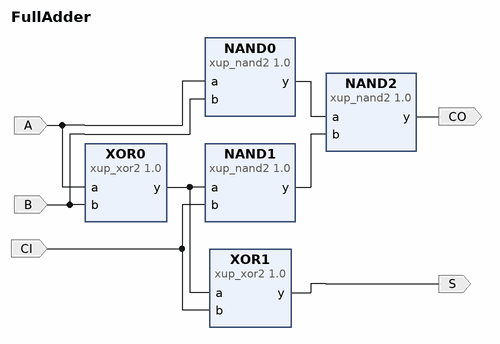
[diagram p0: block diagram of the top level]
# Vivado block design FullAdder, xc7a35tcpg236-1, Vivado 2017.2
create_bd_design FullAdder

create_bd_port -dir I A
create_bd_port -dir I B
create_bd_port -dir I CI
create_bd_port -dir O S
create_bd_port -dir O CO

create_bd_cell -type ip -vlnv xilinx.com:xup:xup_xor2:1.0 XOR0
create_bd_cell -type ip -vlnv xilinx.com:xup:xup_xor2:1.0 XOR1
create_bd_cell -type ip -vlnv xilinx.com:xup:xup_nand2:1.0 NAND0
create_bd_cell -type ip -vlnv xilinx.com:xup:xup_nand2:1.0 NAND1
create_bd_cell -type ip -vlnv xilinx.com:xup:xup_nand2:1.0 NAND2

# ---- connections ----

connect_bd_net [get_bd_pins XOR1/y] [get_bd_ports S]
connect_bd_net [get_bd_pins NAND0/y] [get_bd_pins NAND2/a]
connect_bd_net [get_bd_pins NAND1/y] [get_bd_pins NAND2/b]
connect_bd_net [get_bd_pins NAND2/y] [get_bd_ports CO]
connect_bd_net [get_bd_ports A] [get_bd_pins XOR0/a] [get_bd_pins NAND0/a]
connect_bd_net [get_bd_ports B] [get_bd_pins XOR0/b] [get_bd_pins NAND0/b]
connect_bd_net [get_bd_pins XOR0/y] [get_bd_pins XOR1/a] [get_bd_pins NAND1/a]
connect_bd_net [get_bd_ports CI] [get_bd_pins XOR1/b] [get_bd_pins NAND1/b]

validate_bd_design
save_bd_design
